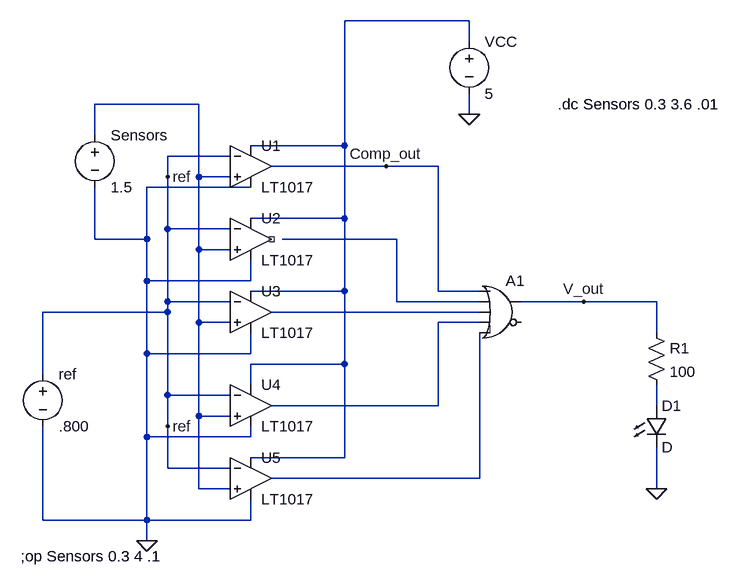
[diagram p0: schematic logic.asc]
logic.asc, the LTspice schematic file:
Version 4
SHEET 1 968 792
WIRE 576 -48 384 -48
WIRE 576 -16 576 -48
WIRE 160 80 0 80
WIRE 576 96 576 64
WIRE 0 128 0 80
WIRE 384 144 384 -48
WIRE 384 144 240 144
WIRE 208 160 112 160
WIRE 448 176 272 176
WIRE 528 176 448 176
WIRE 112 192 112 160
WIRE 160 192 160 80
WIRE 208 192 160 192
WIRE 240 208 80 208
WIRE 384 256 384 144
WIRE 384 256 240 256
WIRE 112 272 112 192
WIRE 208 272 112 272
WIRE 0 288 0 208
WIRE 80 288 80 208
WIRE 80 288 0 288
WIRE 464 288 288 288
WIRE 160 304 160 192
WIRE 208 304 160 304
WIRE 80 352 80 288
WIRE 240 352 240 320
WIRE 240 352 80 352
WIRE 384 368 384 256
WIRE 384 368 240 368
WIRE 528 368 528 176
WIRE 592 368 528 368
WIRE 112 384 112 272
WIRE 208 384 112 384
WIRE 464 384 464 288
WIRE 592 384 464 384
WIRE 752 384 656 384
WIRE 864 384 752 384
WIRE 112 400 112 384
WIRE 112 400 -80 400
WIRE 592 400 272 400
WIRE 160 416 160 304
WIRE 208 416 160 416
WIRE 592 416 528 416
WIRE 864 432 864 384
WIRE 80 464 80 352
WIRE 240 464 240 432
WIRE 240 464 80 464
WIRE 384 480 384 368
WIRE 384 480 240 480
WIRE -80 496 -80 400
WIRE 240 512 240 480
WIRE 112 528 112 400
WIRE 208 528 112 528
WIRE 528 544 528 416
WIRE 528 544 272 544
WIRE 864 544 864 512
WIRE 160 560 160 416
WIRE 208 560 160 560
WIRE 112 576 112 528
WIRE 80 592 80 464
WIRE 240 592 240 576
WIRE 240 592 80 592
WIRE 384 624 384 480
WIRE 384 624 240 624
WIRE 112 640 112 576
WIRE 208 640 112 640
WIRE 592 656 592 432
WIRE 592 656 272 656
WIRE 160 672 160 560
WIRE 208 672 160 672
WIRE 864 672 864 608
WIRE -80 720 -80 576
WIRE 80 720 80 592
WIRE 80 720 -80 720
WIRE 240 720 240 688
WIRE 240 720 80 720
WIRE 80 752 80 720
FLAG 80 752 0
FLAG 864 672 0
FLAG 752 384 V_out
FLAG 448 176 Comp_out
FLAG 112 192 ref
FLAG 112 576 ref
FLAG 576 96 0
SYMBOL voltage 0 112 R0
WINDOW 123 0 0 Left 0
WINDOW 39 0 0 Left 0
SYMATTR InstName Sensors
SYMATTR Value 1.5
SYMBOL Comparators\\LT1017 240 176 R0
SYMATTR InstName U1
SYMBOL Comparators\\LT1017 240 288 R0
SYMATTR InstName U2
SYMBOL Comparators\\LT1017 240 400 R0
SYMATTR InstName U3
SYMBOL Comparators\\LT1017 240 544 R0
SYMATTR InstName U4
SYMBOL Comparators\\LT1017 240 656 R0
SYMATTR InstName U5
SYMBOL Digital\\or 624 336 R0
SYMATTR InstName A1
SYMBOL res 848 416 R0
SYMATTR InstName R1
SYMATTR Value 100
SYMBOL LED 848 544 R0
SYMATTR InstName D1
SYMBOL voltage -80 480 R0
WINDOW 123 0 0 Left 0
WINDOW 39 0 0 Left 0
SYMATTR InstName ref
SYMATTR Value .800
SYMBOL voltage 576 -32 R0
WINDOW 123 0 0 Left 0
WINDOW 39 0 0 Left 0
SYMATTR InstName VCC
SYMATTR Value 5
TEXT -114 776 Left 2 !;op Sensors 0.3 4 .1
TEXT 712 80 Left 2 !.dc Sensors 0.3 3.6 .01

The netlist it stands for:
* logic.asc
V§Sensors N002 0 1.5
XU1 N002 ref N001 0 Comp_out LT1017  ; pins In+ In- V+ V- OUT
XU2 N002 ref N001 0 NC_01 LT1017  ; pins In+ In- V+ V- OUT
XU3 N002 ref N001 0 N004 LT1017  ; pins In+ In- V+ V- OUT
XU4 N002 ref N001 0 N005 LT1017  ; pins In+ In- V+ V- OUT
XU5 N002 ref N001 0 N007 LT1017  ; pins In+ In- V+ V- OUT
A1 Comp_out N003 N004 N005 N007 0 V_out 0 OR
R1 V_out N006 100
D1 N006 0 D
V§ref ref 0 .800
VCC N001 0 5
.model D D
.lib standard.dio
;op Sensors 0.3 4 .1
.dc Sensors 0.3 3.6 .01
.backanno
.end